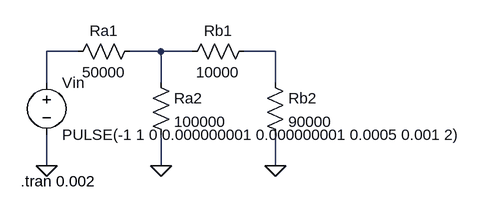
[diagram p0: schematic CircuitAB-PartB.asc]
CircuitAB-PartB.asc, the LTspice schematic file:
Version 4.1
SHEET 1 880 680
WIRE 112 64 64 64
WIRE 240 64 192 64
WIRE 288 64 240 64
WIRE 416 64 368 64
WIRE 64 112 64 64
WIRE 240 112 240 64
WIRE 416 112 416 64
WIRE 64 240 64 192
WIRE 240 240 240 192
WIRE 416 240 416 192
FLAG 416 240 0
FLAG 240 240 0
FLAG 64 240 0
SYMBOL voltage 64 96 R0
WINDOW 123 0 0 Left 0
WINDOW 39 0 0 Left 0
SYMATTR InstName Vin
SYMATTR Value PULSE(-1 1 0 0.000000001 0.000000001 0.0005 0.001 2)
SYMBOL res 208 48 R90
WINDOW 0 0 56 VBottom 2
WINDOW 3 32 56 VTop 2
SYMATTR InstName Ra1
SYMATTR Value 50000
SYMBOL res 224 96 R0
SYMATTR InstName Ra2
SYMATTR Value 100000
SYMBOL res 384 48 R90
WINDOW 0 0 56 VBottom 2
WINDOW 3 32 56 VTop 2
SYMATTR InstName Rb1
SYMATTR Value 10000
SYMBOL res 400 96 R0
SYMATTR InstName Rb2
SYMATTR Value 90000
TEXT 24 264 Left 2 !.tran 0.002

The netlist it stands for:
* CircuitAB-PartB.asc
Vin N001 0 PULSE(-1 1 0 0.000000001 0.000000001 0.0005 0.001 2)
Ra1 N002 N001 50000
Ra2 N002 0 100000
Rb1 N003 N002 10000
Rb2 N003 0 90000
.tran 0.002
.backanno
.end